# Altium schematic sheet MCU.SchDoc
size A2; SheetNumber: 3; SheetTotal: 8
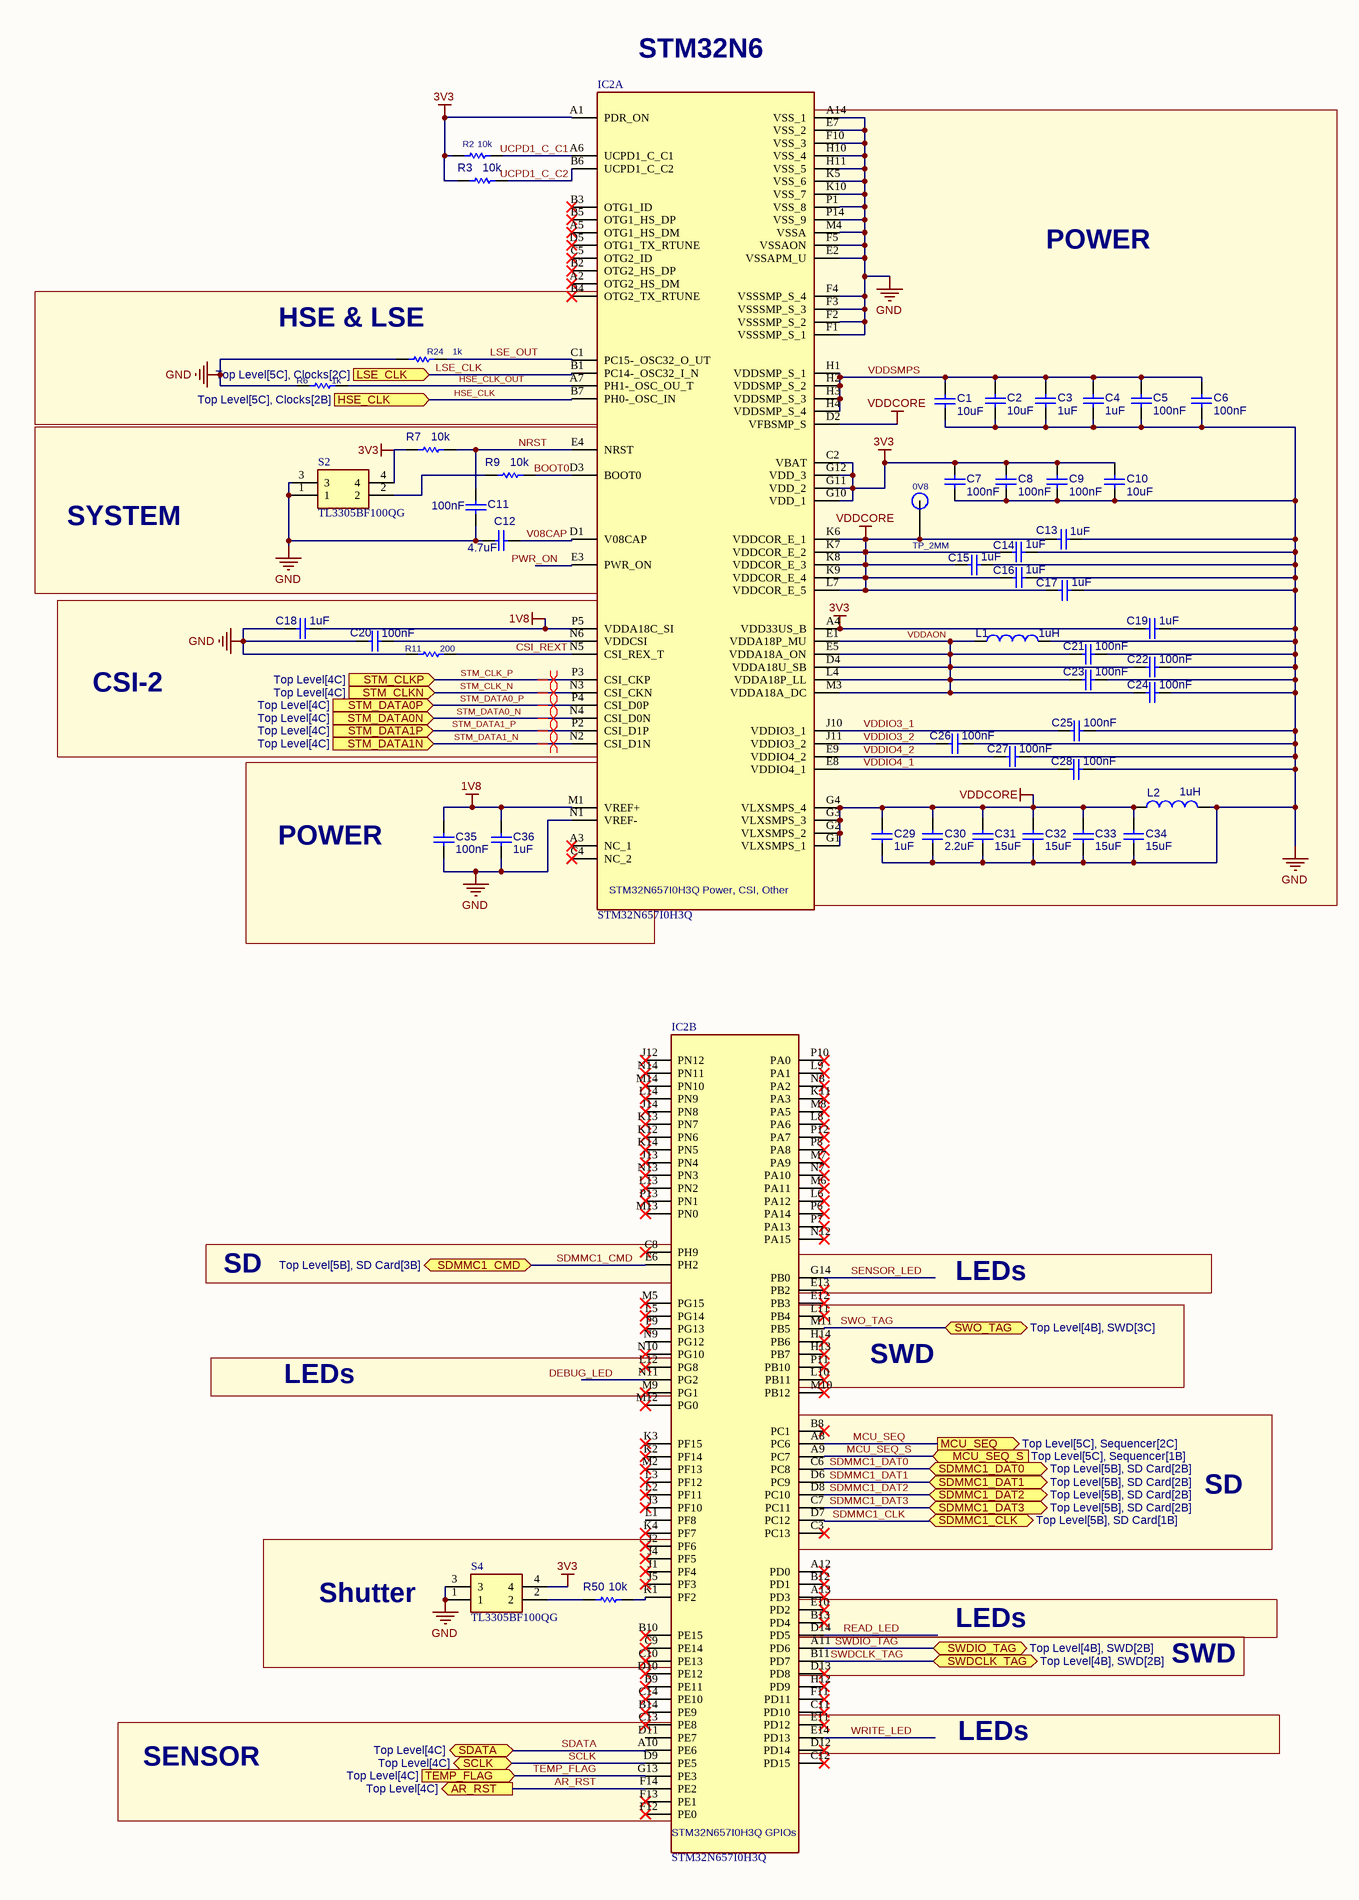
[diagram p0: MCU.SchDoc, left]
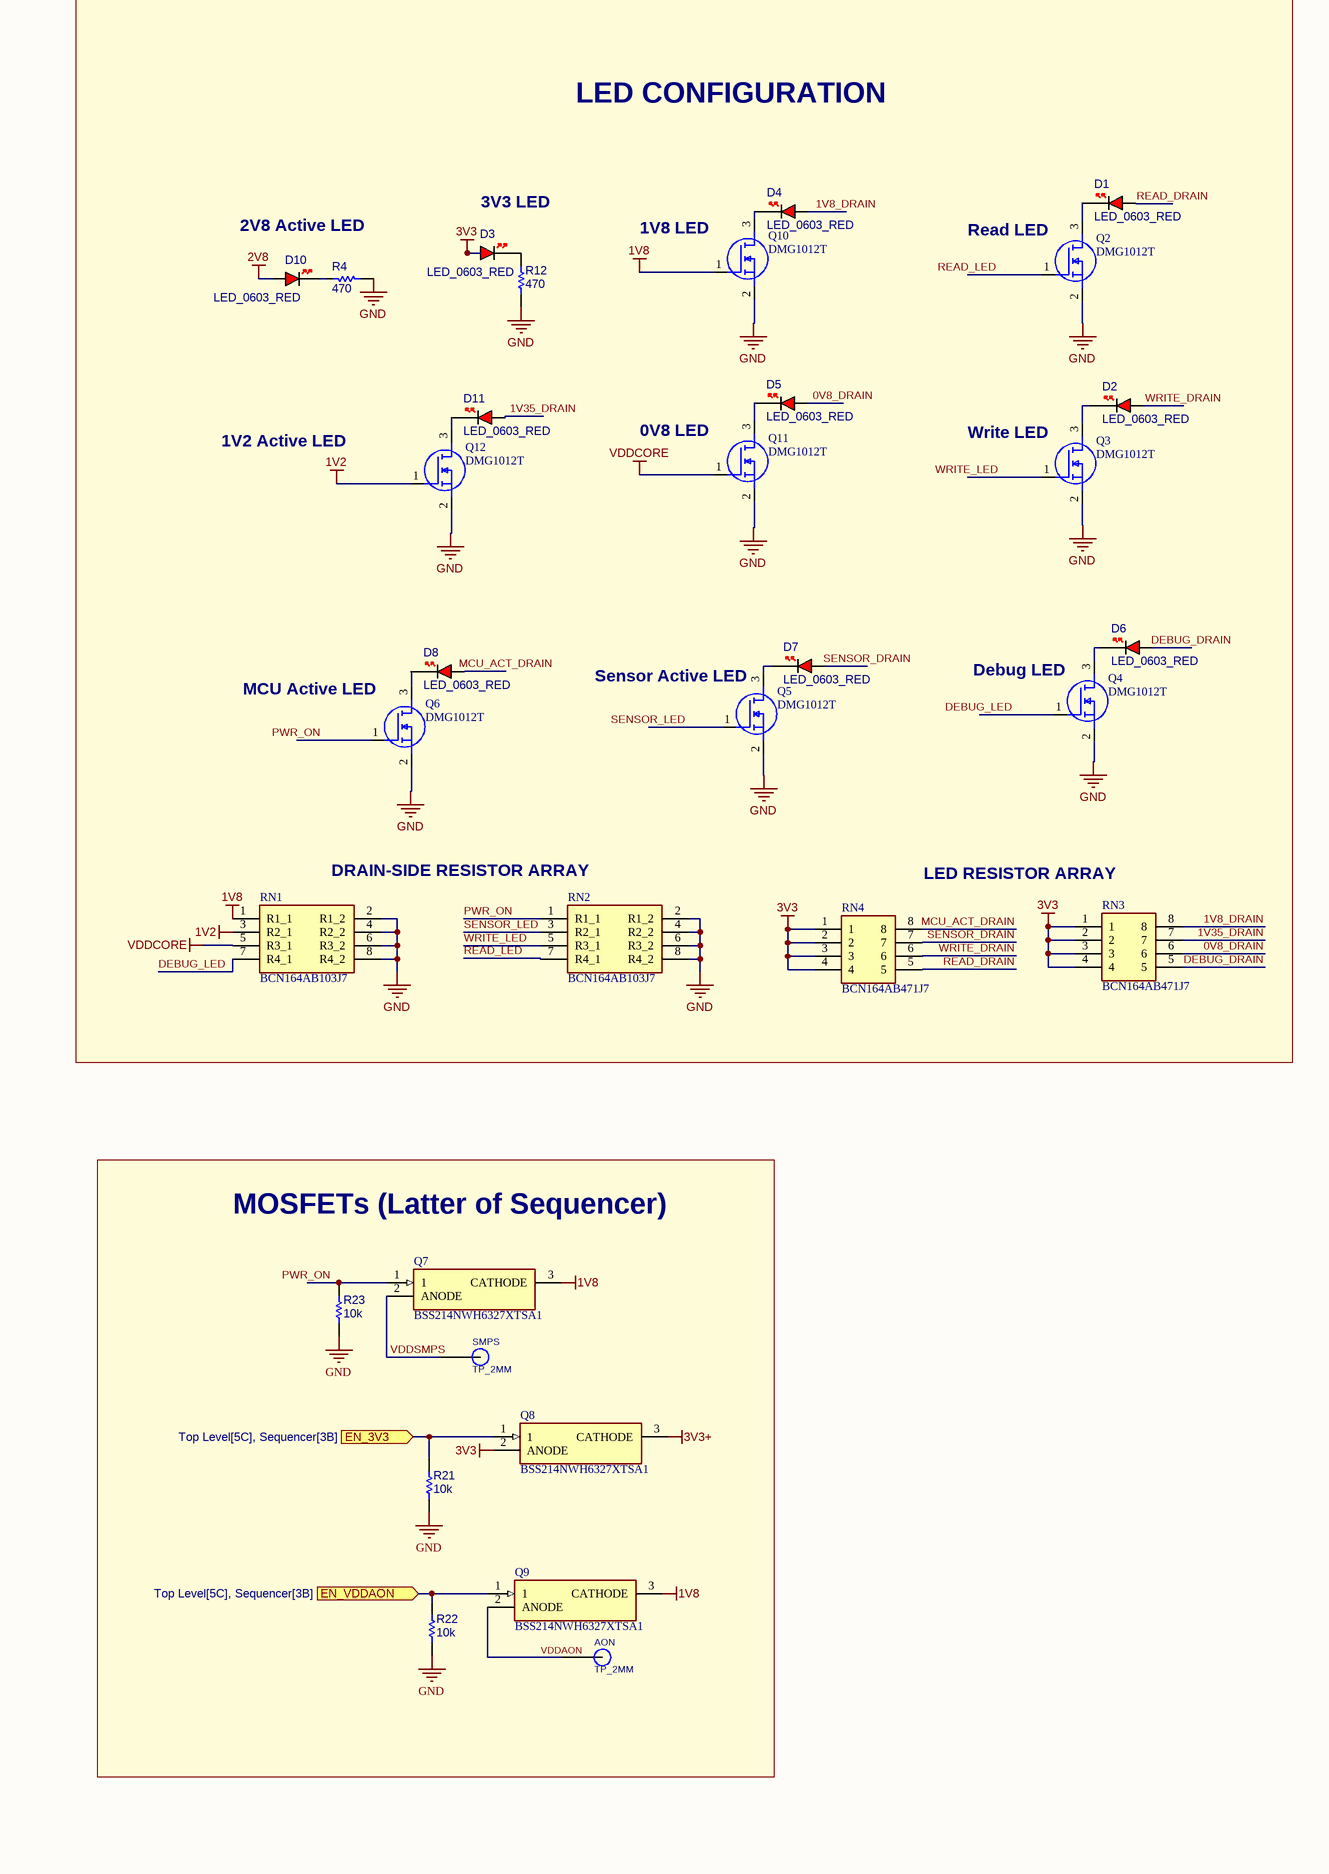
[diagram p1: MCU.SchDoc, right]

## Parts
0V8  TP_2MM  [TESTPOINT 2MM]
AON  TP_2MM  [TESTPOINT 2MM]
C1  value 10uF  [C0603]  (hidden comment: MCD-00237)
C2  value 10uF  [C0603]  (hidden comment: MCD-00237)
C3  value 1uF  [C0603]  (hidden comment: MCD-00237)
C4  value 1uF  [C0603]  (hidden comment: MCD-00237)
C5  value 100nF  [C0603]  (hidden comment: MCD-00237)
C6  value 100nF  [C0603]  (hidden comment: MCD-00237)
C7  value 100nF  [C0603]  (hidden comment: MCD-00237)
C8  value 100nF  [C0603]  (hidden comment: MCD-00237)
C9  value 100nF  [C0603]  (hidden comment: MCD-00237)
C10  value 10uF  [C0603]  (hidden comment: MCD-00237)
C11  value 100nF  [C0603]  (hidden comment: MCD-00237)
C12  value 4.7uF  [C0603]  (hidden comment: MCD-00237)
C13  value 1uF  [C0603]  (hidden comment: MCD-00237)
C14  value 1uF  [C0603]  (hidden comment: MCD-00237)
C15  value 1uF  [C0603]  (hidden comment: MCD-00237)
C16  value 1uF  [C0603]  (hidden comment: MCD-00237)
C17  value 1uF  [C0603]  (hidden comment: MCD-00237)
C18  value 1uF  [C0603]  (hidden comment: MCD-00237)
C19  value 1uF  [C0603]  (hidden comment: MCD-00237)
C20  value 100nF  [C0603]  (hidden comment: MCD-00237)
C21  value 100nF  [C0603]  (hidden comment: MCD-00237)
C22  value 100nF  [C0603]  (hidden comment: MCD-00237)
C23  value 100nF  [C0603]  (hidden comment: MCD-00237)
C24  value 100nF  [C0603]  (hidden comment: MCD-00237)
C25  value 100nF  [C0603]  (hidden comment: MCD-00237)
C26  value 100nF  [C0603]  (hidden comment: MCD-00237)
C27  value 100nF  [C0603]  (hidden comment: MCD-00237)
C28  value 100nF  [C0603]  (hidden comment: MCD-00237)
C29  value 1uF  [C0603]  (hidden comment: MCD-00237)
C30  value 2.2uF  [C0603]  (hidden comment: MCD-00237)
C31  value 15uF  [C0603]  (hidden comment: MCD-00237)
C32  value 15uF  [C0603]  (hidden comment: MCD-00237)
C33  value 15uF  [C0603]  (hidden comment: MCD-00237)
C34  value 15uF  [C0603]  (hidden comment: MCD-00237)
C35  value 100nF  [C0603]  (hidden comment: MCD-00237)
C36  value 1uF  [C0603]  (hidden comment: MCD-00237)
D1  LED_0603_RED  [LED_0603_RED]
D2  LED_0603_RED  [LED_0603_RED]
D3  LED_0603_RED  [LED_0603_RED]
D4  LED_0603_RED  [LED_0603_RED]
D5  LED_0603_RED  [LED_0603_RED]
D6  LED_0603_RED  [LED_0603_RED]
D7  LED_0603_RED  [LED_0603_RED]
D8  LED_0603_RED  [LED_0603_RED]
D10  LED_0603_RED  [LED_0603_RED]
D11  LED_0603_RED  [LED_0603_RED]
IC2  STM32N657I0H3Q  [BGA178C80P14X14_1200X1200X100]  (parts A,B of 2)
L1  1uH  [INDC1608X90X30LL10T20]
L2  1uH  [INDC1608X90X30LL10T20]
Q2  DMG1012T  [SOT50P160X90-3N]
Q3  DMG1012T  [SOT50P160X90-3N]
Q4  DMG1012T  [SOT50P160X90-3N]
Q5  DMG1012T  [SOT50P160X90-3N]
Q6  DMG1012T  [SOT50P160X90-3N]
Q7  BSS214NWH6327XTSA1  [BSS214NWH6327XTSA1]
Q8  BSS214NWH6327XTSA1  [BSS214NWH6327XTSA1]
Q9  BSS214NWH6327XTSA1  [BSS214NWH6327XTSA1]
Q10  DMG1012T  [SOT50P160X90-3N]
Q11  DMG1012T  [SOT50P160X90-3N]
Q12  DMG1012T  [SOT50P160X90-3N]
R2  value 10k  [RESC1608X55X25ML10T15-1]  (hidden comment: Resistor 10k +/-1% 0603 100mW)
R3  value 10k  [RESC1608X55X25ML10T15-1]  (hidden comment: Resistor 10k +/-1% 0603 100mW)
R4  value 470  [RESC1608X55X25ML10T15-1]  (hidden comment: Resistor 10k +/-1% 0603 100mW)
R6  value 1k  [RESC1608X55X25ML10T15-1]  (hidden comment: Resistor 10k +/-1% 0603 100mW)
R7  value 10k  [RESC1608X55X25ML10T15-1]  (hidden comment: Resistor 10k +/-1% 0603 100mW)
R9  value 10k  [RESC1608X55X25ML10T15-1]  (hidden comment: Resistor 10k +/-1% 0603 100mW)
R11  value 200  [RESC1608X55X25ML10T15-1]  (hidden comment: Resistor 10k +/-1% 0603 100mW)
R12  value 470  [RESC1608X55X25ML10T15-1]  (hidden comment: Resistor 10k +/-1% 0603 100mW)
R21  value 10k  [RESC1608X55X25ML10T15-1]  (hidden comment: Resistor 10k +/-1% 0603 100mW)
R22  value 10k  [RESC1608X55X25ML10T15-1]  (hidden comment: Resistor 10k +/-1% 0603 100mW)
R23  value 10k  [RESC1608X55X25ML10T15-1]  (hidden comment: Resistor 10k +/-1% 0603 100mW)
R24  value 1k  [RESC1608X55X25ML10T15-1]  (hidden comment: Resistor 10k +/-1% 0603 100mW)
R50  value 10k  [RESC1608X55X25ML10T15-1]  (hidden comment: Resistor 10k +/-1% 0603 100mW)
RN1  BCN164AB103J7  [BCN164AB103J7]
RN2  BCN164AB103J7  [BCN164AB103J7]
RN3  BCN164AB471J7  [BCN164AB471J7]
RN4  BCN164AB471J7  [BCN164AB471J7]
S2  TL3305BF100QG  [TL3305BF100QG]
S4  TL3305BF100QG  [TL3305BF100QG]
SMPS  TP_2MM  [TESTPOINT 2MM]

## Blocks framed on the sheet
LED CONFIGURATION: D1-D8 D10 D11 Q2-Q6 Q10-Q12 R4 R12 RN1-RN4
POWER: 0V8 C1-C10 C13-C17 C19 C21-C34 IC2 L1 L2
HSE & LSE: R6 R24
SYSTEM: C11 C12 R7 R9 S2
CSI-2: C18 C20 R11
POWER: C35 C36
MOSFETs (Latter of Sequencer): AON Q7-Q9 R21-R23 SMPS
Shutter: R50 S4

## Ports
AR_RST (out, see Top Level[4C]), EN_3V3 (in, see Top Level[5C], Sequencer[3B]), EN_VDDAON (in, see Top Level[5C], Sequencer[3B]), HSE_CLK (in, see Top Level[5C], Clocks[2B]), LSE_CLK (in, see Top Level[5C], Clocks[2C]), MCU_SEQ (out, see Top Level[5C], Sequencer[2C]), MCU_SEQ_S (in, see Top Level[5C], Sequencer[1B]), SCLK (bidir, see Top Level[4C]), SDATA (bidir, see Top Level[4C]), SDMMC1_CLK (bidir, see Top Level[5B], SD Card[1B]), SDMMC1_CMD (bidir, see Top Level[5B], SD Card[3B]), SDMMC1_DAT0 (bidir, see Top Level[5B], SD Card[2B]), SDMMC1_DAT1 (bidir, see Top Level[5B], SD Card[2B]), SDMMC1_DAT2 (bidir, see Top Level[5B], SD Card[2B]), SDMMC1_DAT3 (bidir, see Top Level[5B], SD Card[2B]), STM_CLKN (in, see Top Level[4C]), STM_CLKP (in, see Top Level[4C]), STM_DATA0N (in, see Top Level[4C]), STM_DATA0P (in, see Top Level[4C]), STM_DATA1N (in, see Top Level[4C]), STM_DATA1P (in, see Top Level[4C]), SWDCLK_TAG (bidir, see Top Level[4B], SWD[2B]), SWDIO_TAG (bidir, see Top Level[4B], SWD[2B]), SWO_TAG (bidir, see Top Level[4B], SWD[3C]), TEMP_FLAG (in, see Top Level[4C])

## Nets
1V2: Q12.1(G) RN1.3(R2_1)
1V8: C18.2 C35.2 C36.2 IC2.M1(VREF+) IC2.P5(VDDA18C_SI) Q7.3(CATHODE) Q9.3(CATHODE) Q10.1(G) RN1.1(R1_1)
2V8: D10.A
3V3: C7.2 C8.2 C9.2 C10.2 C19.1 D3.A IC2.A1(PDR_ON) IC2.A4(VDD33US_B) IC2.C2(VBAT) IC2.G10(VDD_1) IC2.G11(VDD_2) IC2.G12(VDD_3) Q8.2(ANODE) R2.1 R3.1 R7.1 RN3.1 RN3.2 RN3.3 RN3.4 RN4.1 RN4.2 RN4.3 RN4.4 S2.4 S4.4
3V3+: Q8.3(CATHODE)
GND: C1.1 C2.1 C3.1 C4.1 C5.1 C6.1 C7.1 C8.1 C9.1 C10.1 C11.1 C12.1 C13.2 C14.2 C15.2 C16.2 C17.2 C18.1 C19.2 C20.1 C21.2 C22.2 C23.2 C24.2 C25.2 C26.2 C27.2 C28.2 C29.1 C30.2 C31.2 C32.1 C33.1 C34.2 C35.1 C36.1 IC2.A14(VSS_1) IC2.E2(VSSAPM_U) IC2.E7(VSS_2) IC2.F1(VSSSMP_S_1) IC2.F2(VSSSMP_S_2) IC2.F3(VSSSMP_S_3) IC2.F4(VSSSMP_S_4) IC2.F5(VSSAON) IC2.F10(VSS_3) IC2.H10(VSS_4) IC2.H11(VSS_5) IC2.K5(VSS_6) IC2.K10(VSS_7) IC2.M4(VSSA) IC2.N1(VREF-) IC2.P1(VSS_8) IC2.P14(VSS_9) L1.2 L2.2 Q2.2(S) Q3.2(S) Q4.2(S) Q5.2(S) Q6.2(S) Q10.2(S) Q11.2(S) Q12.2(S) R4.1 R6.1 R11.1 R12.2 R21.2 R22.2 R23.2 R24.2 RN1.2(R1_2) RN1.4(R2_2) RN1.6(R3_2) RN1.8(R4_2) RN2.2(R1_2) RN2.4(R2_2) RN2.6(R3_2) RN2.8(R4_2) S2.1 S2.3 S4.1 S4.3
VDDCORE: 0V8.TP(TP_2MM) C13.1 C14.1 C15.1 C16.1 C17.1 C29.2 C30.1 C31.1 C32.2 C33.2 C34.1 IC2.D2(VFBSMP_S) IC2.G1(VLXSMPS_1) IC2.G2(VLXSMPS_2) IC2.G3(VLXSMPS_3) IC2.G4(VLXSMPS_4) IC2.K6(VDDCOR_E_1) IC2.K7(VDDCOR_E_2) IC2.K8(VDDCOR_E_3) IC2.K9(VDDCOR_E_4) IC2.L7(VDDCOR_E_5) L2.1 Q11.1(G) RN1.5(R3_1)
0V8_DRAIN: D5.A RN3.6
1V8_DRAIN: D4.A RN3.8
1V35_DRAIN: D11.A RN3.7
AR_RST: IC2.F14(PE2) ; port AR_RST
BOOT0: IC2.D3(BOOT0) R9.2
CSI_REXT: IC2.N5(CSI_REX_T) R11.2
DEBUG_DRAIN: D6.A RN3.5
DEBUG_LED: IC2.N11(PG2) Q4.1(G) RN1.7(R4_1)
EN_3V3: Q8.1 R21.1 ; port EN_3V3
EN_VDDAON: Q9.1 R22.1 ; port EN_VDDAON
HSE_CLK: IC2.B7(PH0-_OSC_IN) ; port HSE_CLK
HSE_CLK_OUT: IC2.A7(PH1-_OSC_OU_T) R6.2
LSE_CLK: IC2.B1(PC14-_OSC32_I_N) ; port LSE_CLK
LSE_OUT: IC2.C1(PC15-_OSC32_O_UT) R24.1
MCU_ACT_DRAIN: D8.A RN4.8
MCU_SEQ: IC2.A8(PC6) ; port MCU_SEQ
MCU_SEQ_S: IC2.A9(PC7) ; port MCU_SEQ_S
NRST: C11.2 IC2.E4(NRST) R7.2
PWR_ON: IC2.E3(PWR_ON) Q6.1(G) Q7.1 R23.1 RN2.1(R1_1)
READ_DRAIN: D1.A RN4.5
READ_LED: IC2.D14(PD5) Q2.1(G) RN2.7(R4_1)
SCLK: IC2.D9(PE5) ; port SCLK
SDATA: IC2.A10(PE6) ; port SDATA
SDMMC1_CLK: IC2.D7(PC12) ; port SDMMC1_CLK
SDMMC1_CMD: IC2.E6(PH2) ; port SDMMC1_CMD
SDMMC1_DAT0: IC2.C6(PC8) ; port SDMMC1_DAT0
SDMMC1_DAT1: IC2.D6(PC9) ; port SDMMC1_DAT1
SDMMC1_DAT2: IC2.D8(PC10) ; port SDMMC1_DAT2
SDMMC1_DAT3: IC2.C7(PC11) ; port SDMMC1_DAT3
SENSOR_DRAIN: D7.A RN4.7
SENSOR_LED: IC2.G14(PB0) Q5.1(G) RN2.3(R2_1)
STM_CLK_N: IC2.N3(CSI_CKN) ; port STM_CLKN
STM_CLK_P: IC2.P3(CSI_CKP) ; port STM_CLKP
STM_DATA0_N: IC2.N4(CSI_D0N) ; port STM_DATA0N
STM_DATA0_P: IC2.P4(CSI_D0P) ; port STM_DATA0P
STM_DATA1_N: IC2.N2(CSI_D1N) ; port STM_DATA1N
STM_DATA1_P: IC2.P2(CSI_D1P) ; port STM_DATA1P
SWDCLK_TAG: IC2.B11(PD7) ; port SWDCLK_TAG
SWDIO_TAG: IC2.A11(PD6) ; port SWDIO_TAG
SWO_TAG: IC2.M11(PB5) ; port SWO_TAG
TEMP_FLAG: IC2.G13(PE3) ; port TEMP_FLAG
UCPD1_C_C1: IC2.A6(UCPD1_C_C1) R2.2
UCPD1_C_C2: IC2.B6(UCPD1_C_C2) R3.2
V08CAP: C12.2 IC2.D1(V08CAP)
VDDAON: AON.TP(TP_2MM) C21.1 C22.1 C23.1 C24.1 IC2.D4(VDDA18U_SB) IC2.E1(VDDA18P_MU) IC2.E5(VDDA18A_ON) IC2.L4(VDDA18P_LL) IC2.M3(VDDA18A_DC) L1.1 Q9.2(ANODE)
VDDIO3_1: C25.1 IC2.J10(VDDIO3_1)
VDDIO3_2: C26.1 IC2.J11(VDDIO3_2)
VDDIO4_1: C28.1 IC2.E8(VDDIO4_1)
VDDIO4_2: C27.1 IC2.E9(VDDIO4_2)
VDDSMPS: C1.2 C2.2 C3.2 C4.2 C5.2 C6.2 IC2.H1(VDDSMP_S_1) IC2.H2(VDDSMP_S_2) IC2.H3(VDDSMP_S_3) IC2.H4(VDDSMP_S_4) Q7.2(ANODE) SMPS.TP(TP_2MM)
WRITE_DRAIN: D2.A RN4.6
WRITE_LED: IC2.E14(PD13) Q3.1(G) RN2.5(R3_1)
NetC20_2: C20.2 IC2.N6(VDDCSI)
NetD1_K: D1.K Q2.3(D)
NetD2_K: D2.K Q3.3(D)
NetD3_K: D3.K R12.1
NetD4_K: D4.K Q10.3(D)
NetD5_K: D5.K Q11.3(D)
NetD6_K: D6.K Q4.3(D)
NetD7_K: D7.K Q5.3(D)
NetD8_K: D8.K Q6.3(D)
NetD10_K: D10.K R4.2
NetD11_K: D11.K Q12.3(D)
NetIC2_K1: IC2.K1(PF2) R50.2
NetR9_1: R9.1 S2.2
NetR50_1: R50.1 S4.2

Not connected (* = marked no-connect by the designer): IC2 A2(OTG2_HS_DM)* A3(NC_1)* A5(OTG1_HS_DM)* A12(PD0)* A13(PD3)* B2(OTG2_HS_DP)* B3(OTG1_ID)* B4(OTG2_TX_RTUNE)* B5(OTG1_HS_DP)* B8(PC1)* B9(PE11)* B10(PE15)* B12(PD1)* B13(PD4)* B14(PE9)* C3(PC13)* C4(NC_2)* C5(OTG2_ID)* C8(PH9)* C9(PE14)* C10(PE13)* C11(PD10)* C12(PD15)* C13(PE8)* C14(PE10)* D5(OTG1_TX_RTUNE)* D10(PE12)* D11(PE7) D12(PD14)* D13(PD8)* E10(PD2)* E11(PD12)* E12(PB3)* E13(PB2)* F11(PD11)* F12(PE0)* F13(PE1)* H12(PD9)* H13(PB7)* H14(PB6)* J1(PF4)* J2(PF6)* J3(PF10)* J4(PF5)* J5(PF3)* J12(PN12)* J13(PN4)* J14(PN8)* K2(PF14)* K3(PF15)* K4(PF7)* K11(PA3)* K12(PN6)* K13(PN7)* K14(PN5)* L1(PF8) L2(PF11)* L3(PF12)* L5(PG14)* L6(PA12)* L8(PA6)* L9(PA1)* L10(PB11)* L11(PB4)* L12(PG8)* L13(PN2)* L14(PN9)* M2(PF13)* M5(PG15)* M6(PA11)* M7(PA9)* M8(PA5)* M9(PG1)* M10(PB12)* M12(PG0)* M13(PN0)* M14(PN10)* N7(PA10)* N8(PA2)* N9(PG12) N10(PG10)* N12(PA15)* N13(PN3)* N14(PN11)* P6(PA14)* P7(PA13)* P8(PA8)* P9(PG13)* P10(PA0)* P11(PB10)* P12(PA7)* P13(PN1)*

## Layout directives
differential pair: STM_CLK_N, STM_CLK_P, STM_DATA0_N, STM_DATA0_P, STM_DATA1_N, STM_DATA1_P

## Notes on the sheet
- STM32N6
- 3V3 LED
- 2V8 Active LED
- (near Q10) 1V8 LED
- (near Q2) Read LED
- 1V2 Active LED
- (near Q11) 0V8 LED
- (near Q3) Write LED
- (near Q5) Sensor Active LED
- (near Q4) Debug LED
- (near Q6) MCU Active LED
- DRAIN-SIDE RESISTOR ARRAY
- LED RESISTOR ARRAY
- SD
- LEDs
- SWD
- SENSOR
- (in symbol STM32N657I0H3Q, part A) STM32N657I0H3Q Power, CSI, Other
- (in symbol STM32N657I0H3Q, part B) STM32N657I0H3Q GPIOs

## Library data of the parts
C1-C36 = CMP-112-000001-1: Capacitor, MLCC, 100nF, 6V3, X5R, 10%, 0603, T=0,8mm; Manufacturer Part Number: CC0603KRX5R5BB104; Manufacturer: YAGEO; ECCN_EU: NEC; Provided_By: SUBCO; ECCN_US: EAR99; Status: Released; ComponentLink1Description: Datasheet; Component Type: Capacitors; Pin Count: 2; Package: C0603; Source: MB1364.SCHLIB; Design Item ID: MCD-00237; Part_Type: Capacitor; Internal_Part_Number: MCD-00237; ComponentLink1URL: http://tunmcdsvn.tun.st.com/Component_Datasheet_Library/Trunk/Capacitors/Yageo_Multilayer_capacitor_X5R_series_100pF_to_100uF; Manufacturer_Part_Number: CC0603KRX5R5BB104
D1-D8 D10 D11 = CMP-007-000026-1: LED 0603 RED SMD; Design Item ID: LED_0603_RED; Source: Schematic-Lib-PhilsLab.SchLib
IC2 = STM32N657I0H3Q: Integrated Circuit; Manufacturer_Name: STMicroelectronics; Datasheet Link: https://www.st.com/resource/en/datasheet/stm32n657a0.pdf; Height: 1mm; Manufacturer_Part_Number: STM32N657I0H3Q; Mouser Part Number: 511-STM32N657I0H3Q; Mouser Price/Stock: https://www.mouser.co.uk/ProductDetail/STMicroelectronics/STM32N657I0H3Q?qs=a2MtRaTmNOQAexZMsq8u8A%3D%3D; Arrow Part Number: STM32N657I0H3Q; Arrow Price/Stock: https://www.arrow.com/en/products/stm32n657i0h3q/stmicroelectronics?utm_currency=USD&region=nac
L1 L2 = CMP-2000-05913-1: Unshielded Wirewound Inductor, 33 nH, 350 mA, -55 to 150 degC, 0603 (1608 Metric), RoHS, Tape and Reel; Manufacturer: EPCOS-(TDK); Q @ Freq: 14@100MHz; Inductance: 33nH; Material - Core: Ceramic; Frequency - Self Resonant: 3GHz; DC Resistance (DCR): 600mOhmMax; Tolerance: ±5%; Frequency - Test: 100MHz; Current Rating: 350mA; Manufacturer URL: http://www.tdk.com/; Type: Wirewound; Mounting Type: SurfaceMount; Mounting Technology: SurfaceMount; Height - Seated (Max): 0.035"(0.90mm); Datasheet URL: https://en.tdk.eu/inf/30/db/ind_2008/b82496c.pdf; Shielding: Unshielded; Operating Temperature: -; Size / Dimension: 0.063"Lx0.031"W(1.60mmx0.80mm); Series: SIMID; Current - Saturation: -; Ratings: AEC-Q200; Packaging: CutTape(CT); Package Reference: 0603; Datasheet Version: 07/2016; Category: Inductors,Coils,Chokes; Package Description: 2-Pin Surface Mount Device, Body 1.6 x 0.8 mm; Family: FixedInductors; Package / Case: 0603(1608Metric)
Q2-Q6 Q10-Q12 = DMG1012T: MOSFET (N-Channel); Manufacturer_Name: Diodes Incorporated; Datasheet Link: https://www.diodes.com/datasheet/download/DMG1012T.pdf; Height: 0.9mm; Manufacturer_Part_Number: DMG1012T; Mouser Part Number: N/A; Mouser Price/Stock: https://www.mouser.co.uk/ProductDetail/Diodes-Incorporated/DMG1012T?qs=Wj%2FVkw3K%252BMD5naxckZUW%2FA%3D%3D
Q7-Q9 = BSS214NWH6327XTSA1: Transistor; Manufacturer_Name: Infineon; Datasheet Link: http://www.mouser.com/ds/2/196/BSS214NW_Rev2.2-359325.pdf; Height: 1mm; Manufacturer_Part_Number: BSS214NWH6327XTSA1; Mouser Part Number: 726-BSS214NWH6327XTS; Mouser Price/Stock: https://www.mouser.co.uk/ProductDetail/Infineon-Technologies/BSS214NWH6327XTSA1?qs=Dj8dEyEphkMe%252Bfnz0ZE2og%3D%3D; Arrow Part Number: BSS214NWH6327XTSA1; Arrow Price/Stock: https://www.arrow.com/en/products/bss214nwh6327xtsa1/infineon-technologies-ag?utm_currency=USD&region=nac
R2-R4 R6 R7 R9 R11 R12 R21-R24 R50 = CMP-009-00181-1: Chip Resistor, 10k Ohm, 0.1 W, -55 to 155 degC, 0603 (1608 Metric); Voltage Rating: 50V; Tolerance: 1%; Source: Components - 14.11.22 - 11.28.SchLib; Design Item ID: CMP-009-00006-5; Created by: Micah Randall; Power: 100mW; Max Operating Temperature: 155°C; RoHS Compliant: Yes; Mounting Technology: SM; Case/Package: 0603; Min Operating Temperature: -55°C; Pins: 2
RN1 RN2 = BCN164AB103J7: Resistor Network; Manufacturer_Name: IRC / TT Electronics; Datasheet Link: https://componentsearchengine.com/Datasheets/1/BCN164AB103J7.pdf; Height: 0.6mm; Manufacturer_Part_Number: BCN164AB103J7; Mouser Part Number: 858-BCN164AB103J7; Mouser Price/Stock: https://www.mouser.co.uk/ProductDetail/IRC-TT-Electronics/BCN164AB103J7?qs=sKpblPcrDFAYmBHclHBIlw%3D%3D; Arrow Part Number: BCN164AB103J7; Arrow Price/Stock: https://www.arrow.com/en/products/bcn164ab103j7/irc
RN3 RN4 = BCN164AB471J7: Resistor Network; Manufacturer_Name: TT Electronics; Datasheet Link: https://www.mouser.com/datasheet/2/414/BCN-1154942.pdf; Height: 0.6mm; Manufacturer_Part_Number: BCN164AB471J7; Mouser Part Number: 858-BCN164AB471J7
S2 S4 = TL3305BF100QG: Switch; Manufacturer_Name: E-Switch; Datasheet Link: https://configured-product-images.s3.amazonaws.com/2D/specs/TL3305BF100QG.pdf; Manufacturer_Part_Number: TL3305BF100QG; Mouser Part Number: 612-TL3305BF100QG; Mouser Price/Stock: https://www.mouser.co.uk/ProductDetail/E-Switch/TL3305BF100QG?qs=IKkN%2F947nfDIPwqPQja%252BvQ%3D%3D